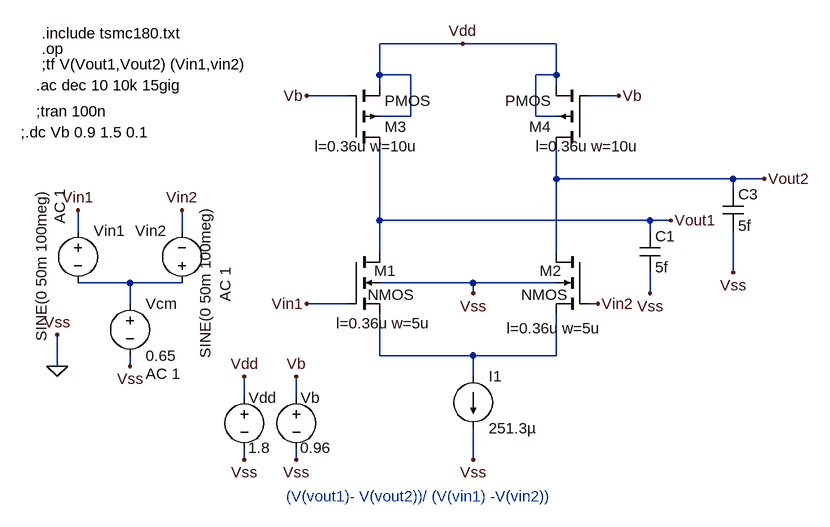
[diagram p0: schematic DP-for 10GHz.asc]
DP-for 10GHz.asc, the LTspice schematic file:
Version 4
SHEET 1 1300 680
WIRE 752 -64 624 -64
WIRE 896 -64 752 -64
WIRE 624 -16 624 -64
WIRE 672 -16 624 -16
WIRE 896 -16 896 -64
WIRE 896 -16 864 -16
WIRE 624 0 624 -16
WIRE 896 0 896 -16
WIRE 576 16 512 16
WIRE 992 16 944 16
WIRE 672 48 672 -16
WIRE 672 48 624 48
WIRE 864 48 864 -16
WIRE 896 48 864 48
WIRE 896 144 896 96
WIRE 1168 144 896 144
WIRE 1216 144 1168 144
WIRE 1168 160 1168 144
WIRE 624 208 624 96
WIRE 1040 208 624 208
WIRE 1072 208 1040 208
WIRE 160 224 160 192
WIRE 320 224 320 192
WIRE 1040 224 1040 208
WIRE 624 256 624 208
WIRE 896 256 896 144
WIRE 1168 288 1168 224
WIRE 240 304 160 304
WIRE 320 304 240 304
WIRE 768 304 624 304
WIRE 896 304 768 304
WIRE 768 320 768 304
WIRE 1040 320 1040 288
WIRE 240 336 240 304
WIRE 576 336 512 336
WIRE 960 336 944 336
WIRE 624 416 624 352
WIRE 768 416 624 416
WIRE 896 416 896 352
WIRE 896 416 768 416
WIRE 128 432 128 384
WIRE 240 432 240 416
WIRE 768 448 768 416
WIRE 416 480 416 448
WIRE 496 480 496 448
WIRE 416 576 416 560
WIRE 496 576 496 560
WIRE 768 576 768 528
FLAG 128 432 0
FLAG 128 384 Vss
FLAG 416 576 Vss
FLAG 240 432 Vss
FLAG 416 448 Vdd
FLAG 512 336 Vin1
FLAG 752 -64 Vdd
FLAG 960 336 Vin2
FLAG 768 576 Vss
FLAG 768 320 Vss
FLAG 160 192 Vin1
FLAG 320 192 Vin2
FLAG 512 16 Vb
FLAG 992 16 Vb
FLAG 496 576 Vss
FLAG 496 448 Vb
FLAG 1216 144 Vout2
FLAG 1168 288 Vss
FLAG 1072 208 Vout1
FLAG 1040 320 Vss
SYMBOL nmos4 576 256 R0
WINDOW 0 40 29 Left 2
WINDOW 3 30 66 Left 2
WINDOW 123 127 110 Right 2
SYMATTR InstName M1
SYMATTR Value2 l=0.36u w=5u
SYMBOL voltage 416 464 R0
WINDOW 123 0 0 Left 0
WINDOW 39 0 0 Left 0
WINDOW 0 7 17 Left 2
WINDOW 3 6 94 Left 2
SYMATTR InstName Vdd
SYMATTR Value 1.8
SYMBOL nmos4 944 256 M0
WINDOW 0 40 29 Left 2
WINDOW 3 30 66 Left 2
WINDOW 123 -21 118 Left 2
SYMATTR InstName M2
SYMATTR Value2 l=0.36u w=5u
SYMBOL current 768 448 R0
WINDOW 123 0 0 Left 0
WINDOW 39 0 0 Left 0
SYMATTR InstName I1
SYMATTR Value 251.3µ
SYMBOL voltage 240 320 R0
WINDOW 123 24 124 Left 2
WINDOW 39 0 0 Left 0
SYMATTR Value2 AC 1
SYMATTR InstName Vcm
SYMATTR Value 0.65
SYMBOL voltage 160 208 R0
WINDOW 3 -56 -48 VRight 2
WINDOW 123 -28 -48 VRight 2
WINDOW 39 0 0 Left 0
SYMATTR Value SINE(0 50m 100meg)
SYMATTR Value2 AC 1
SYMATTR InstName Vin1
SYMBOL voltage 320 320 R180
WINDOW 0 24 96 Left 2
WINDOW 3 -36 -100 VRight 2
WINDOW 123 -67 -13 VRight 2
WINDOW 39 0 0 Left 0
SYMATTR InstName Vin2
SYMATTR Value SINE(0 50m 100meg)
SYMATTR Value2 AC 1
SYMBOL pmos4 576 96 M180
WINDOW 123 -52 2 Left 2
SYMATTR Value2 l=0.36u w=10u
SYMATTR InstName M3
SYMBOL pmos4 944 96 R180
WINDOW 123 -79 2 Left 2
SYMATTR Value2 l=0.36u w=10u
SYMATTR InstName M4
SYMBOL voltage 496 464 R0
WINDOW 123 0 0 Left 0
WINDOW 39 0 0 Left 0
WINDOW 0 7 17 Left 2
WINDOW 3 6 94 Left 2
SYMATTR InstName Vb
SYMATTR Value 0.96
SYMBOL cap 1152 160 R0
SYMATTR InstName C3
SYMATTR Value 5f
SYMBOL cap 1024 224 R0
SYMATTR InstName C1
SYMATTR Value 5f
TEXT 104 -80 Left 2 !.include tsmc180.txt
TEXT 104 -56 Left 2 !.op
TEXT 104 -32 Left 2 !;tf V(Vout1,Vout2) (Vin1,vin2)
TEXT 96 0 Left 2 !.ac dec 10 10k 15gig
TEXT 96 40 Left 2 !;tran 100n
TEXT 480 632 Left 2 ;(V(vout1)- V(vout2))/ (V(vin1) -V(vin2))
TEXT 72 72 Left 2 !;.dc Vb 0.9 1.5 0.1

The netlist it stands for:
* DP-for 10GHz.asc
M1 Vout1 Vin1 N002 0 NMOS l=0.36u w=5u
Vdd Vdd 0 1.8
M2 Vout2 Vin2 N002 0 NMOS l=0.36u w=5u
I1 N002 0 251.3µ
Vcm N001 0 0.65 AC 1
Vin1 Vin1 N001 SINE(0 50m 100meg) AC 1
Vin2 N001 Vin2 SINE(0 50m 100meg) AC 1
M3 Vout1 Vb Vdd Vdd PMOS l=0.36u w=10u
M4 Vout2 Vb Vdd Vdd PMOS l=0.36u w=10u
Vb Vb 0 0.96
C3 Vout2 0 5f
C1 Vout1 0 5f
.model NMOS NMOS
.model PMOS PMOS
.lib standard.mos
.include tsmc180.txt
.op
;tf V(Vout1,Vout2) (Vin1,vin2)
.ac dec 10 10k 15gig
;tran 100n
* (V(vout1)- V(vout2))/ (V(vin1) -V(vin2))
;.dc Vb 0.9 1.5 0.1
.backanno
.end